# Altium schematic sheet NPN_CONNECTOR.SchDoc
size A4
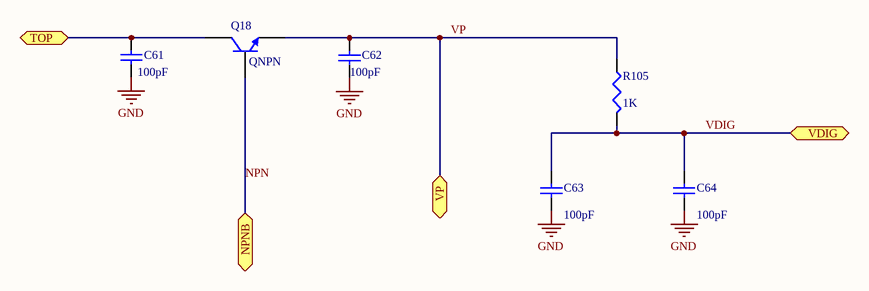
[diagram p0: NPN_CONNECTOR.SchDoc]

## Parts
C61  value 100pF  [C1206]  (hidden comment: Cap Semi)
C62  value 100pF  [C1206]  (hidden comment: Cap Semi)
C63  value 100pF  [C1206]  (hidden comment: Cap Semi)
C64  value 100pF  [C1206]  (hidden comment: Cap Semi)
Q18  QNPN  [ZXTN4004KTCDICT-ND]
R105  value 1K  [J1-0603]  (hidden comment: Res3)

## Ports
NPNB, TOP, VDIG, VP

## Nets
GND: C61.2 C62.1 C63.1 C64.1
NPN: Q18.2(B) ; port NPNB
TOP: C61.1 Q18.1(C) ; port TOP
VDIG: C63.2 C64.2 R105.2 ; port VDIG
VP: C62.2 Q18.3(E) R105.1 ; port VP

## Library data of the parts
C61-C64 = Cap Semi: Capacitor (Semiconductor SIM Model); Published: 8-Jun-2000; LatestRevisionDate: 29-May-2009; LatestRevisionNote: IPC-7351 Footprint Added.; PackageReference: C1206; Publisher: Altium Limited; PackageDescription: Chip Capacitor
Q18 = QNPN: NPN Bipolar Transistor; Manufacturer: Diodes; Manufacturer Part Number: ZXTN4004KTC; Max Power Dissipation: 3.8W; Number of Elements: 1; hFE Min: 100; Collector Emitter Voltage (VCEO): 150V; Emitter Base Voltage (VEBO): 7V; Continuous Collector Current: 1A; Element Configuration: Single; Published: 8-Jun-2000; LatestRevisionDate: 29-May-2009; LatestRevisionNote: IPC-7351 Footprint Added.; PackageVersion: Aug-1999; PackageReference: SOT-23B; Publisher: Altium Limited; PackageDescription: 3-Pin SOT-23 Package 0.95 mm Pitch, 2.4 mm Lead Span; Supplier 1: Digi-Key; Supplier Part Number 1: ZXTN4004KTCDICT-ND; Stock 1: 0; Pricing 1: 1=0.49, 10=0.42, 100=0.3134, 500=0.2463, 1000=0.1903 (USD); Mount: Surface Mount; Case/Package: TO-252; Number of Pins: 3; Weight: 0.063493oz; Min Operating Temperature: -55°C; Max Operating Temperature: 150°C; Packaging: Tape and Reel; Package Quantity: 2500; Polarity: NPN; Collector Base Voltage (VCBO): 150V; Max Collector Current: 1A; Collector Emitter Breakdown Voltage: 150V; Max Breakdown Voltage: 150V; Power Dissipation: 3.8W; Length: 6.7mm; Height: 6.2mm; Width: 2.39mm; Radiation Hardening: No; Lead Free: Lead Free; REACH SVHC: No SVHC
R105 = Res3: Resistor; Published: 8-Jun-2000; LatestRevisionDate: 29-May-2009; LatestRevisionNote: IPC-7351 Footprint Added.; PackageReference: J1-0603; Publisher: Altium Limited; PackageDescription: Chip Resistor